# Altium project TCA.PrjPcb
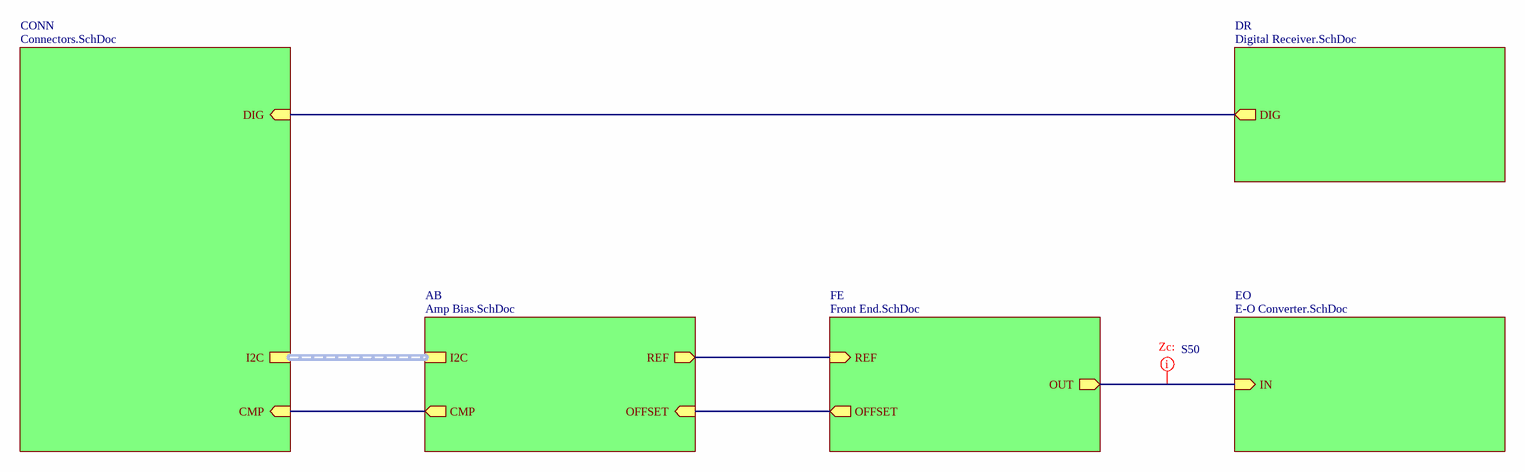
[diagram p0: Top.SchDoc]
6 sheets, 65 parts. Net scope: hierarchical (ports join the sheet entries above them; power ports are global).
Board file: TCA.PcbDoc
Sheets:
  Top.SchDoc
    CONN = Connectors.SchDoc
    AB = Amp Bias.SchDoc
    FE = Front End.SchDoc
    EO = E-O Converter.SchDoc
    DR = Digital Receiver.SchDoc

## Sheet Top.SchDoc
size 406 x 304 mm; SheetNumber: 1; SheetTotal: 6

### Sub-sheets
AB = Amp Bias.SchDoc: REF (out), OFFSET (in), I2C (harness I2C), CMP (out)
CONN = Connectors.SchDoc: I2C (harness I2C), CMP (in), DIG (in)
DR = Digital Receiver.SchDoc: DIG (out)
EO = E-O Converter.SchDoc: IN (in)
FE = Front End.SchDoc: OUT (out), REF (in), OFFSET (out)

### Nets
CMP: sheet CONN/CMP, sheet AB/CMP
DIG: sheet CONN/DIG, sheet DR/DIG
OFFSET: sheet AB/OFFSET, sheet FE/OFFSET
OUT: sheet FE/OUT, sheet EO/IN
REF: sheet AB/REF, sheet FE/REF

### Buses and harness runs
harness sheet AB/I2C = sheet CONN/I2C

### Layout directives
net class S50: OUT

### Notes on the sheet
- Rev
- Sheet Name:
- Date:
- Sheet
- Designer:
- of

## Sheet Connectors.SchDoc
size 406 x 304 mm; SheetNumber: 5; SheetTotal: 6
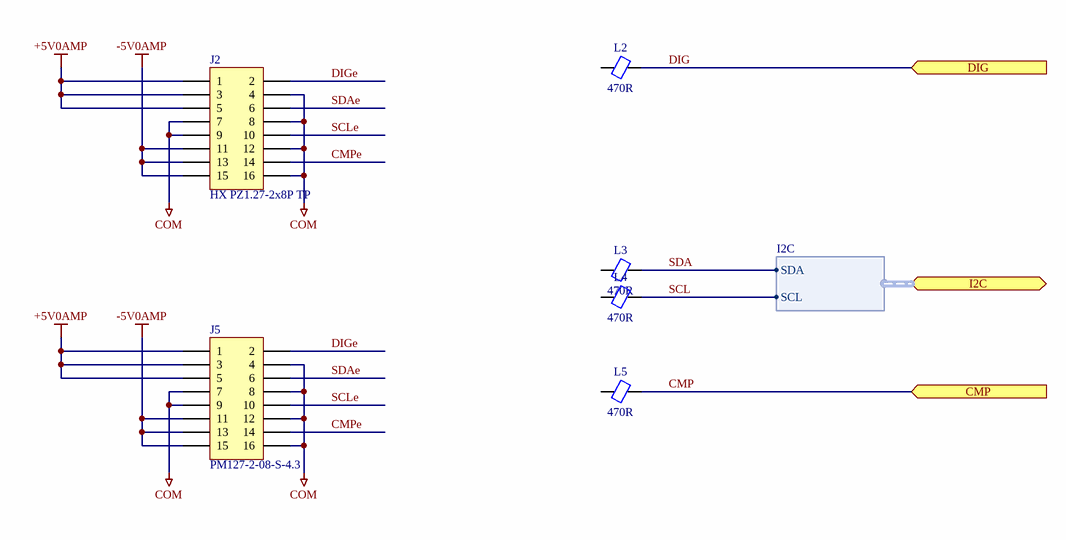
[diagram p1: Connectors.SchDoc]

### Parts
J2  HX PZ1.27-2x8P TP  [HANXIA_HX PZ1.27-2x8P TP]
J5  PM127-2-08-S-4.3  [HCTL_PM127-2-08-S-4.3]
L2  470R  [INDC1005X05N]
L3  470R  [INDC1005X05N]
L4  470R  [INDC1005X05N]
L5  470R  [INDC1005X05N]

### Ports
CMP (in), DIG (in), I2C (bidir, harness I2C)

### Harnesses
I2C: SDA, SCL

### Nets
+5V0AMP: J2.1 J2.3 J2.5 J5.1 J5.3 J5.5
-5V0AMP: J2.11 J2.13 J2.15 J5.11 J5.13 J5.15
COM: J2.4 J2.7 J2.8 J2.9 J2.12 J2.16 J5.4 J5.7 J5.8 J5.9 J5.12 J5.16
CMP: L5.2 ; port CMP
CMPe: J2.14 J5.14
DIG: L2.2 ; port DIG
DIGe: J2.2 J5.2
SCL: L4.2 ; port I2C.SCL
SCLe: J2.10 J5.10
SDA: L3.2 ; port I2C.SDA
SDAe: J2.6 J5.6

Not connected (* = marked no-connect by the designer): L2 1; L3 1; L4 1; L5 1

### Notes on the sheet
- Rev
- Sheet Name:
- Date:
- Sheet
- Designer:
- of

### Library data of the parts
J2 = CONN,Hdr,2x8 Pin,1.27mm,SMD: CONN HEADER 16POS 1.27mm DUAL ROW SMD; Manufacturer 1: hanxia; Vendor 1 Part Number: C41376040; Vendor 1: LCSC; Part Name: CONN,Hdr,2x8 Pin,1.27mm,SMD; CreatedBy: Judd Foster; HelpURL: https://www.lcsc.com/datasheet/C41376040.pdf?spm=wm.sxq.inf.ggs___wm.fly.bg.0.xh&lcsc_vid=T1ELXwUHQlNYVlZRE1JdXlRQFVgNBF1eTlFXBVxWRAAxVlNeQ1lYVlFUQlNXXjsOAxUeFF5JWBYZEEoKFBINSQcJGk4eFQsCAgIaSgADAwAHC0slRFhZUlVVQ08GEwkK; Manufacturer 1 Part Number: HX PZ1.27-2x8P TP
J5 = CONN,Rcpt,2x8 Pin,1.27mm,SMD: CONN SOCKET 16POS 1.27mm DUAL ROW SMD; Manufacturer 1: HCTL; Vendor 1 Part Number: C3975134; Vendor 1: LCSC; Part Name: CONN,Rcpt,2x8 Pin,1.27mm,SMD; CreatedBy: Judd Foster; HelpURL: https://www.lcsc.com/datasheet/C3975134.pdf?spm=wm.sxq.inf.ggs___wm.fly.bg.0.xh&lcsc_vid=T1ELXwUHQlNYVlZRE1JdXlRQFVgNBF1eTlFXBVxWRAAxVlNeQ1lYVldfR1VbXjsOAxUeFF5JWBYZEEoKFBINSQcJGk4dAgUUFAk%3D; Manufacturer 1 Part Number: PM127-2-08-S-4.3
L2-L5 = Ferrite,470R@100MHz,0402: 470 Ohms @ 100 MHz 1 Power Line Ferrite Bead 0402 (1005 Metric) 1A 200mOhm; Manufacturer 1: Murata Electronics; Manufacturer 1 Part Number: BLM15PX471SN1D; Vendor 1 Part Number: 490-10662-1-ND; Vendor 1: Digikey; Part Name: Ferrite,470R@100MHz,0402; CreatedBy: Judd Foster; HelpURL: https://www.murata.com/en-us/products/productdata/8796740059166/ENFA0018.pdf; Value: 470R

## Sheet Amp Bias.SchDoc
size 406 x 304 mm; SheetNumber: 2; SheetTotal: 6
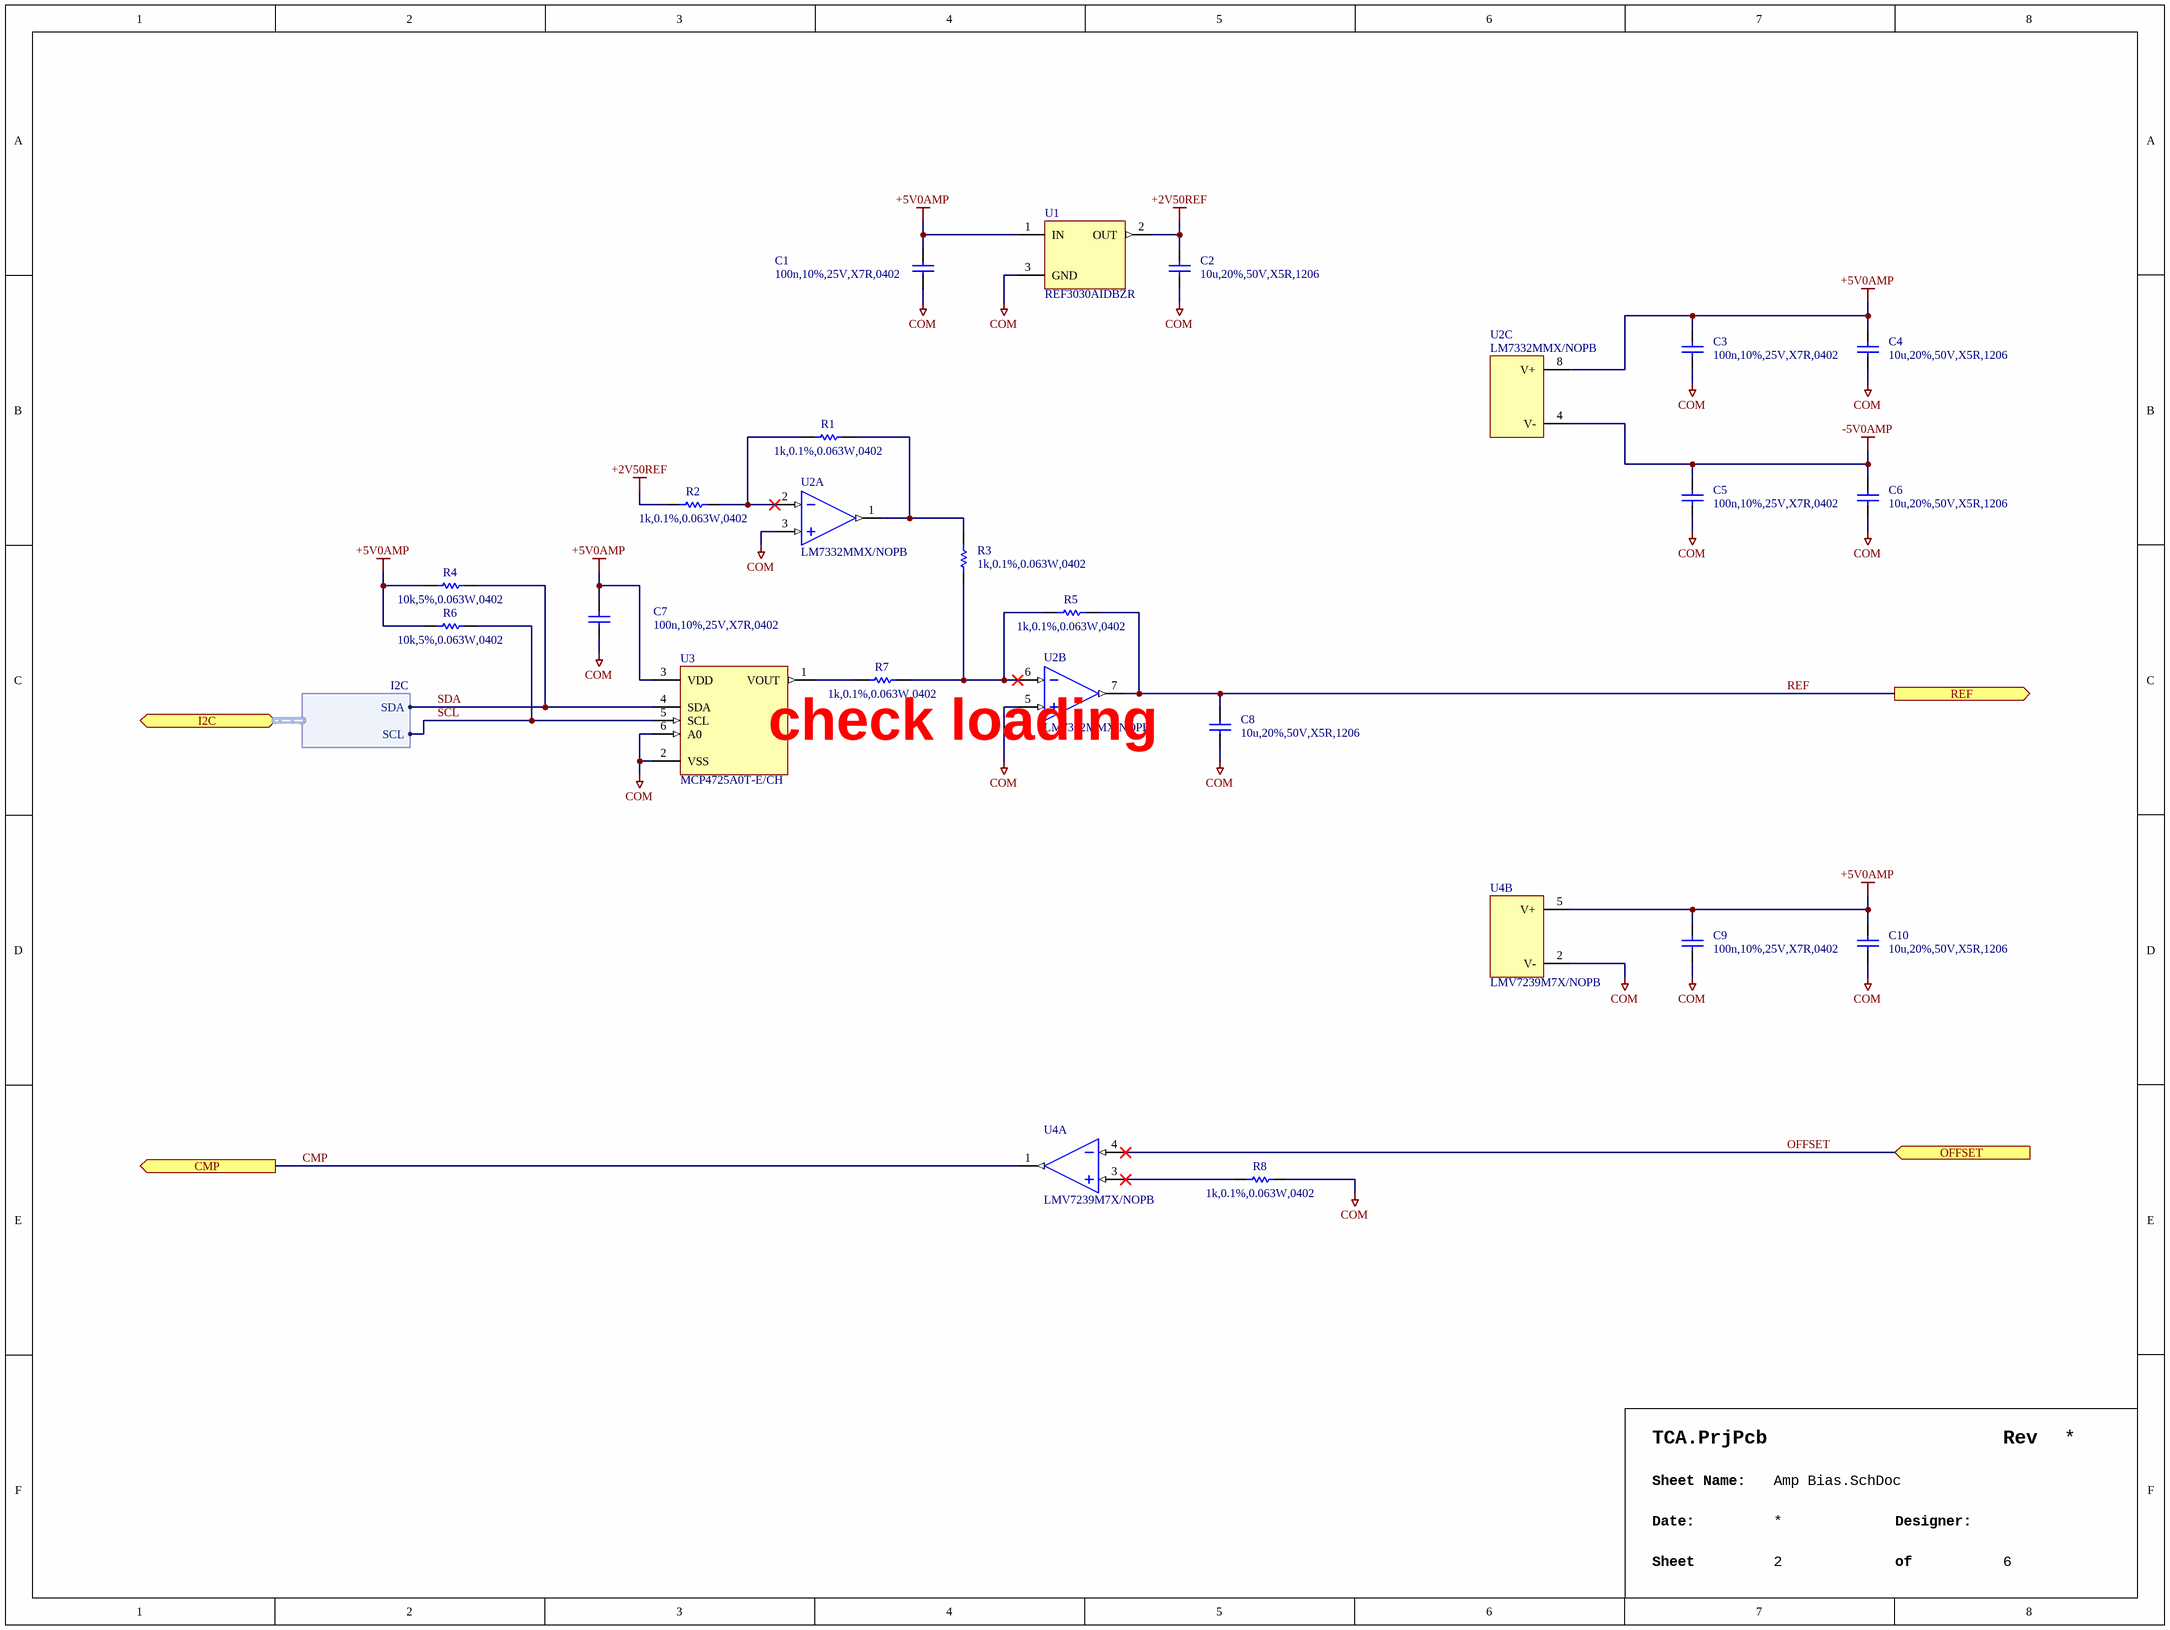
[diagram p2: Amp Bias.SchDoc]

### Parts
C1  100n,10%,25V,X7R,0402  [CAPC1005X06N]
C2  10u,20%,50V,X5R,1206  [CAPC3216X16N]
C3  100n,10%,25V,X7R,0402  [CAPC1005X06N]
C4  10u,20%,50V,X5R,1206  [CAPC3216X16N]
C5  100n,10%,25V,X7R,0402  [CAPC1005X06N]
C6  10u,20%,50V,X5R,1206  [CAPC3216X16N]
C7  100n,10%,25V,X7R,0402  [CAPC1005X06N]
C8  10u,20%,50V,X5R,1206  [CAPC3216X16N]
C9  100n,10%,25V,X7R,0402  [CAPC1005X06N]
C10  10u,20%,50V,X5R,1206  [CAPC3216X16N]
R1  1k,0.1%,0.063W,0402  [RESC1005X04N]
R2  1k,0.1%,0.063W,0402  [RESC1005X04N]
R3  1k,0.1%,0.063W,0402  [RESC1005X04N]
R4  10k,5%,0.063W,0402  [RESC1005X04N]
R5  1k,0.1%,0.063W,0402  [RESC1005X04N]
R6  10k,5%,0.063W,0402  [RESC1005X04N]
R7  1k,0.1%,0.063W,0402  [RESC1005X04N]
R8  1k,0.1%,0.063W,0402  [RESC1005X04N]
U1  REF3030AIDBZR  [SOT95P237X112-3N]
U2  LM7332MMX/NOPB  [TEXASINSTRUMENTS_PKG_DGK0008A]  (parts A,B,C of 3)
U3  MCP4725A0T-E/CH  [SOTFL95P260X145-6]
U4  LMV7239M7X/NOPB  [SOTFL65P210X110-6N]  (parts A,B of 2)

### Ports
CMP (out), I2C (bidir, harness I2C), OFFSET (in), REF (out)

### Harnesses
I2C: SDA, SCL

### Nets
+2V50REF: C2.2 R2.1 U1.2(OUT)
+5V0AMP: C1.2 C3.2 C4.2 C7.2 C9.2 C10.2 R4.2 R6.2 U1.1(IN) U2.8(V+) U3.3(VDD) U4.5(V+)
-5V0AMP: C5.2 C6.2 U2.4(V-)
COM: C1.1 C2.1 C3.1 C4.1 C5.1 C6.1 C7.1 C8.1 C9.1 C10.1 R8.2 U1.3(GND) U2.3(INA+) U2.5(INB+) U3.2(VSS) U3.6(A0) U4.2(V-)
CMP: U4.1(VOUT) ; port CMP
OFFSET: U4.4(IN-) ; port OFFSET
REF: C8.2 R5.2 U2.7(OUTB) ; port REF
SCL: R6.1 U3.5(SCL) ; port I2C.SCL
SDA: R4.1 U3.4(SDA) ; port I2C.SDA
NetR1_1: R1.1 R2.2 U2.2(INA-)
NetR1_2: R1.2 R3.1 U2.1(OUTA)
NetR3_2: R3.2 R5.1 R7.2 U2.6(INB-)
NetR7_1: R7.1 U3.1(VOUT)
NetR8_1: R8.1 U4.3(IN+)

### Notes on the sheet
- check loading
- Rev
- Sheet Name:
- Date:
- Sheet
- Designer:
- of

### Library data of the parts
C1 C3 C5 C7 C9 = CAP,Cer,100nF,10%,25V,X7R,0402: 0.1ï¿½F ï¿½10% 25V Ceramic Capacitor X7R 0402 (1005 Metric); Manufacturer 1: Murata Electronics; Manufacturer 1 Part Number: GRM155R71E104KE14J; Vendor 1 Part Number: 490-14603-1-ND; Vendor 1: DigiKey; Value: 100nF; Part Name: CAP,Cer,100nF,10%,25V,X7R,0402; CreatedBy: Judd Foster; HelpURL: https://search.murata.co.jp/Ceramy/image/img/A01X/G101/ENG/GRM155R71E104KE14-01.pdf
C2 C4 C6 C8 C10 = CAP,Cer,10uF,50VDC,X5R,1206: 10ï¿½F ï¿½20% 50V Ceramic Capacitor X5R 1206 (3216 Metric); Manufacturer 1: Samsung Electro-Mechanics; Manufacturer 1 Part Number: CL31A106MBHNNNE; Vendor 1 Part Number: 1276-6736-1-ND; Vendor 1: Digikey; Part Name: CAP,Cer,10uF,50VDC,X5R,1206; CreatedBy: Judd Foster; HelpURL: https://www.samsungsem.com/resources/file/global/support/product_catalog/MLCC.pdf; Value: 10u
R1-R3 R5 R7 R8 = RES,1k,0.1%,0.063W,0402: 1 kOhms Â±0.1% 0.063W, 1/16W Chip Resistor 0402 (1005 Metric) Thin Film; Manufacturer 1: YAGEO; Manufacturer 1 Part Number: RT0402BRE071KL; Vendor 1 Part Number: YAG2306CT-ND; Vendor 1: DigiKey; Part Name: RES,1k,0.1%,0.063W,0402; CreatedBy: Judd Foster; HelpURL: https://www.yageo.com/upload/media/product/app/datasheet/rchip/pyu-rt_1-to-0.01_rohs_l.pdf; Value: 1k
R4 R6 = RES,10k,5%,0.063W,0402: 10 kOhms ï¿½5% 0.063W, 1/16W Chip Resistor 0402 (1005 Metric) Automotive AEC-Q200 Thick Film; Manufacturer 1: Stackpole Electronics Inc; Manufacturer 1 Part Number: RMCF0402JT10K0; Vendor 1 Part Number: RMCF0402JT10K0CT-ND; Vendor 1: DIgikey; Part Name: RES,10k,5%,0.063W,0402; CreatedBy: Judd Foster; HelpURL: https://www.seielect.com/catalog/sei-rmcf_rmcp.pdf; Value: 10k
U1 = REF3030AIDBZR: 3V ï¿½0.2% 3.05V~5.5V 25mA Fixed SOT-23 Voltage References ROHS; Manufacturer 1: Texas Instruments; Vendor 1 Part Number: C38423; Vendor 1: LCSC; Part Name: REF3030AIDBZR; CreatedBy: Judd Foster; HelpURL: https://www.ti.com/lit/ds/symlink/ref3030.pdf?ts=1702271215532&ref_url=https%253A%252F%252Fwww.ti.com%252Fproduct%252FREF3030%252Fpart-details%252FREF3030AIDBZR; Manufacturer 1 Part Number: REF3030AIDBZR
U2 = LM7332MMX_NOPB: General Purpose Amplifier 2 Circuit Rail-to-Rail 8-VSSOP; Manufacturer 1: Texas Instruments; Vendor 1 Part Number: 296-LM7332MMX/NOPBCT-ND; Vendor 1: DigiKey; Part Name: LM7332MMX_NOPB; CreatedBy: Judd Foster; HelpURL: https://www.ti.com/lit/ds/symlink/lm7332.pdf?HQS=dis-dk-null-digikeymode-dsf-pf-null-wwe&ts=1730932081789&ref_url=https%253A%252F%252Fwww.ti.com%252Fgeneral%252Fdocs%252Fsuppproductinfo.tsp%253FdistId%253D10%2526gotoUrl%253Dhttps%253A%252F%252Fwww.ti.com%; Manufacturer 1 Part Number: LM7332MMX/NOPB
U3 = MCP4725A0T-E/CH: 6us 12 I2C 2.7V~5.5V SOT-23-6 Digital To Analog Converters (DACs) ROHS; Manufacturer 1: Microchip; Vendor 1 Part Number: C144198; Vendor 1: LCSC; Part Name: MCP4725A0T-E/CH; CreatedBy: Judd Foster; HelpURL: https://datasheet.lcsc.com/lcsc/1811151442_Microchip-Tech-MCP4725A0T-E-CH_C144198.pdf; Manufacturer 1 Part Number: MCP4725A0T-E/CH
U4 = LMV7239M7X/NOPB: Comparator General Purpose Push-Pull SC-70-5; Manufacturer 1: Texas Instruments; Vendor 1 Part Number: 296-35198-1-ND; Vendor 1: Digikey; Part Name: LMV7239M7X/NOPB; CreatedBy: Judd Foster; HelpURL: https://www.ti.com/general/docs/suppproductinfo.tsp?distId=10&gotoUrl=https%3A%2F%2Fwww.ti.com%2Flit%2Fgpn%2Flmv7235; Manufacturer 1 Part Number: LMV7239M7X/NOPB

## Sheet Front End.SchDoc
size 406 x 304 mm; SheetNumber: 4; SheetTotal: 6
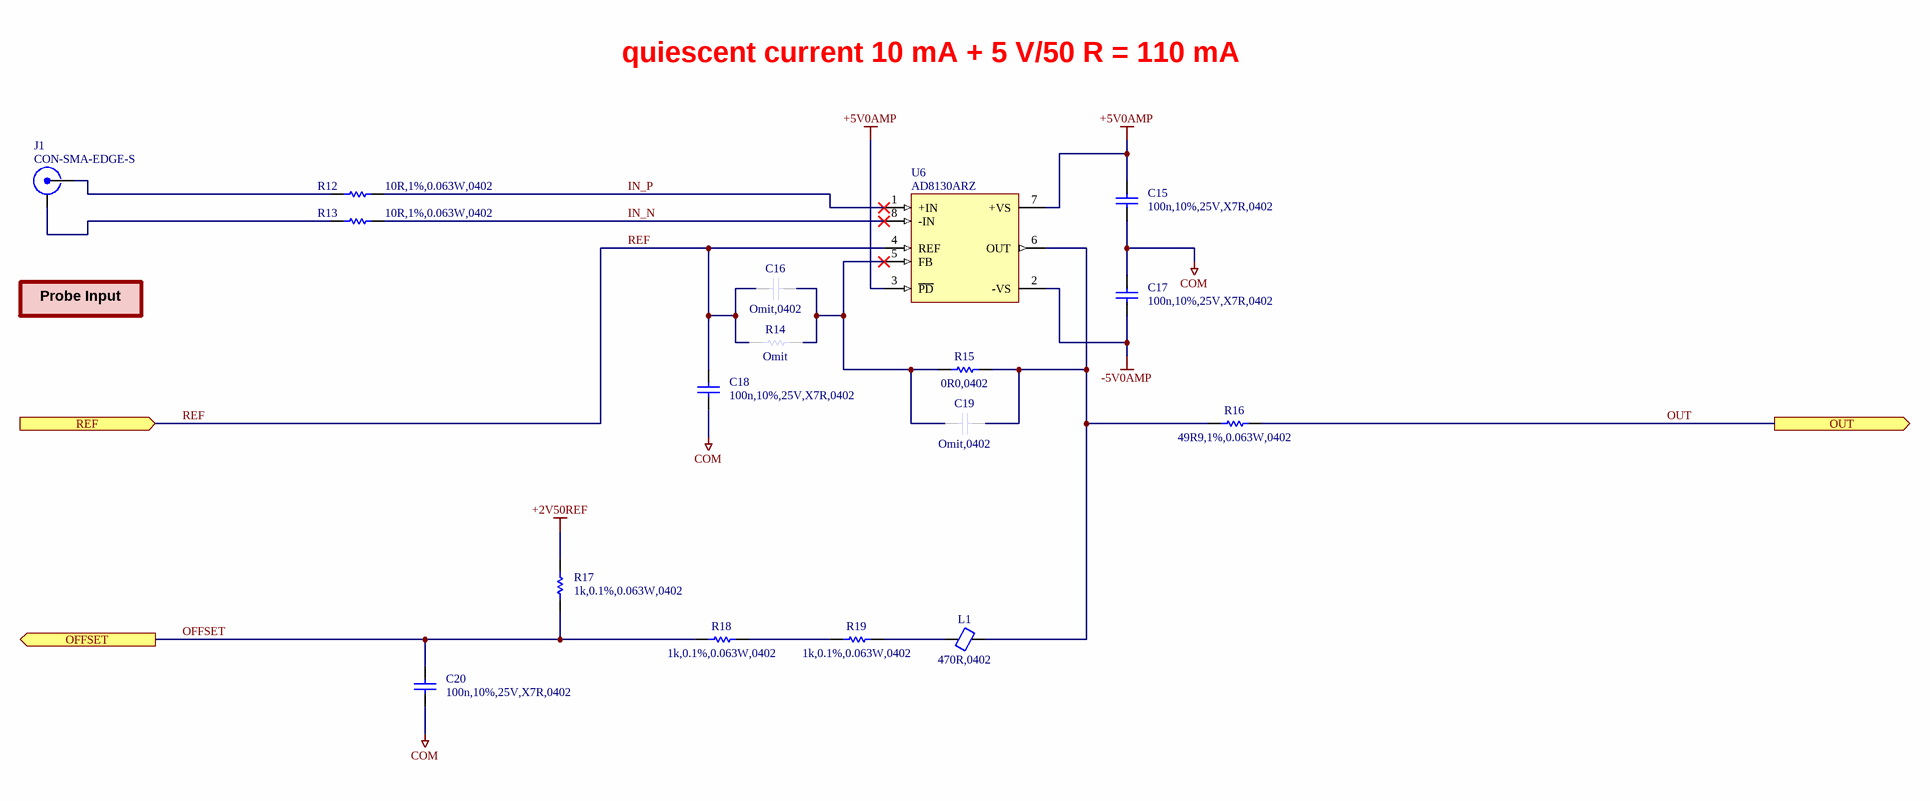
[diagram p3: Front End.SchDoc]

### Parts
C15  100n,10%,25V,X7R,0402  [CAPC1005X06N]
C16  Omit,0402  [CAPC1005X06N]  (no BOM)
C17  100n,10%,25V,X7R,0402  [CAPC1005X06N]
C18  100n,10%,25V,X7R,0402  [CAPC1005X06N]
C19  Omit,0402  [CAPC1005X06N]  (no BOM)
C20  100n,10%,25V,X7R,0402  [CAPC1005X06N]
J1  CON-SMA-EDGE-S  [RFSOLUTIONS_CON-SMA-EDGE-S]
L1  470R,0402  [INDC1005X05N]
R12  10R,1%,0.063W,0402  [RESC1005X04N]
R13  10R,1%,0.063W,0402  [RESC1005X04N]
R14  Omit  [RESC1005X04N]  (no BOM)
R15  0R0,0402  [RESC1005X04N]
R16  49R9,1%,0.063W,0402  [RESC1005X04N]
R17  1k,0.1%,0.063W,0402  [RESC1005X04N]
R18  1k,0.1%,0.063W,0402  [RESC1005X04N]
R19  1k,0.1%,0.063W,0402  [RESC1005X04N]
U6  AD8130ARZ  [ANALOGDEVICES_PKG_R-8]

### Ports
OFFSET (out), OUT (out), REF (in)

### Nets
+2V50REF: R17.2
+5V0AMP: C15.2 U6.3(~{PD}) U6.7(+VS)
-5V0AMP: C17.1 U6.2(-VS)
COM: C15.1 C17.2 C18.1 C20.1
IN_N: R13.2 U6.8(-IN)
IN_P: R12.2 U6.1(+IN)
OFFSET: C20.2 R17.1 R18.1 ; port OFFSET
OUT: R16.2 ; port OUT
REF: C16.1 C18.2 R14.1 U6.4(REF) ; port REF
NetC16_2: C16.2 C19.1 R14.2 R15.1 U6.5(FB)
NetC19_2: C19.2 L1.2 R15.2 R16.1 U6.6(OUT)
NetJ1_1: J1.1(RF) R12.1
NetJ1_2: J1.2(GND) R13.1
NetL1_1: L1.1 R19.2
NetR18_2: R18.2 R19.1

### Notes on the sheet
- quiescent current 10 mA + 5 V/50 R = 110 mA
- Probe Input
- Rev
- Sheet Name:
- Date:
- Sheet
- Designer:
- of

### Library data of the parts
C15 C17 C18 C20 = CAP,Cer,100nF,10%,25V,X7R,0402: as C1 on sheet Amp Bias; Part Name: CAP,Cer,100nF,10%,25V,X7R,0402; CreatedBy: Judd Foster; HelpURL: https://search.murata.co.jp/Ceramy/image/img/A01X/G101/ENG/GRM155R71E104KE14-01.pdf
C16 C19 = CAP,Omit,0402: Omit; Part Name: CAP,Omit,0402; CreatedBy: Judd Foster; HelpURL: N/A; Manufacturer 1: N/A; Manufacturer 1 Part Number: N/A; Vendor 1: N/A; Vendor 1 Part Number: N/A; Value: Omit
J1 = Conn,RF,SMA,Fem,50R,Edge,SMD: SMA Connector Jack, Female Socket Board Edge, End Launch Solder; Manufacturer 1: RF Solutions; Vendor 1 Part Number: CON-SMA-EDGE-S-ND; Vendor 1: DigiKey; Part Name: Conn,RF,SMA,Fem,50R,Edge,SMD; CreatedBy: Judd Foster; HelpURL: https://www.rfsolutions.co.uk/content/download-files/CON-SMA-EDGE-6-DATASHEET.pdf; Manufacturer 1 Part Number: CON-SMA-EDGE-S
L1 = Ferrite,470R@100MHz,0402: 470 Ohms @ 100 MHz 1 Power Line Ferrite Bead 0402 (1005 Metric) 1A 200mOhm; Manufacturer 1: Murata Electronics; Manufacturer 1 Part Number: BLM15PX471SN1D; Vendor 1 Part Number: 490-10662-1-ND; Vendor 1: Digikey; Value: 470; Part Name: Ferrite,470R@100MHz,0402; CreatedBy: Judd Foster; HelpURL: https://www.murata.com/en-us/products/productdata/8796740059166/ENFA0018.pdf
R12 R13 = RES,10R,1%,0.063W,0402: 10 Ohms ï¿½1% 0.063W, 1/16W Chip Resistor 0402 (1005 Metric) Automotive AEC-Q200 Thick Film; Manufacturer 1: Panasonic Electronic Components; Manufacturer 1 Part Number: ERJ-2RKF10R0X; Vendor 1 Part Number: P10.0LCT-ND; Vendor 1: Digikey; Part Name: RES,10R,1%,0.063W,0402; CreatedBy: Judd Foster; HelpURL: https://industrial.panasonic.com/cdbs/www-data/pdf/RDA0000/AOA0000C304.pdf; Value: 10R
R14 = RES,Omit,0402: Part Name: RES,Omit,0402; CreatedBy: Judd Foster; HelpURL: N/A; Manufacturer 1: N/A; Manufacturer 1 Part Number: N/A; Vendor 1: N/A; Vendor 1 Part Number: N/A; Value: Omit
R15 = RES,0R0,0402: 0 Ohms Jumper 0.1W, 1/10W Chip Resistor 0402 (1005 Metric) Automotive AEC-Q200 Thick Film; Manufacturer 1: Panasonic Electronic Components; Manufacturer 1 Part Number: ERJ-2GE0R00X; Vendor 1 Part Number: P0.0JCT-ND; Vendor 1: Digikey; Value: 0; Part Name: RES,0R0,0402; CreatedBy: Judd Foster; HelpURL: https://industrial.panasonic.com/cdbs/www-data/pdf/RDA0000/AOA0000C301.pdf
R16 = RES,49R9,1%,0.063W,0402: 49.9 Ohms Â±1% 0.063W, 1/16W Chip Resistor 0402 (1005 Metric) Moisture Resistant Thick Film; Manufacturer 1: YAGEO; Manufacturer 1 Part Number: RC0402FR-0749R9L; Vendor 1 Part Number: 311-49.9LRCT-ND; Vendor 1: DigiKey; Part Name: RES,49R9,1%,0.063W,0402; CreatedBy: Judd Foster; HelpURL: https://www.yageo.com/upload/media/product/products/datasheet/rchip/PYu-RC_Group_51_RoHS_L_12.pdf; Value: 49R9
R17-R19 = RES,1k,0.1%,0.063W,0402: as R1 on sheet Amp Bias; Part Name: RES,1k,0.1%,0.063W,0402; CreatedBy: Judd Foster; HelpURL: https://www.yageo.com/upload/media/product/app/datasheet/rchip/pyu-rt_1-to-0.01_rohs_l.pdf; Value: 1k
U6 = AD8130ARZ: Differential Amplifier 1 Circuit 8-SOIC; Manufacturer 1: Analog Devices; Vendor 1 Part Number: 505-AD8130ARZ-ND; Vendor 1: DigiKey; Part Name: AD8130ARZ; CreatedBy: Judd Foster; HelpURL: https://www.analog.com/media/en/technical-documentation/data-sheets/AD8129_8130.pdf; Manufacturer 1 Part Number: AD8130ARZ

## Sheet E-O Converter.SchDoc
size 406 x 304 mm; SheetNumber: 3; SheetTotal: 6
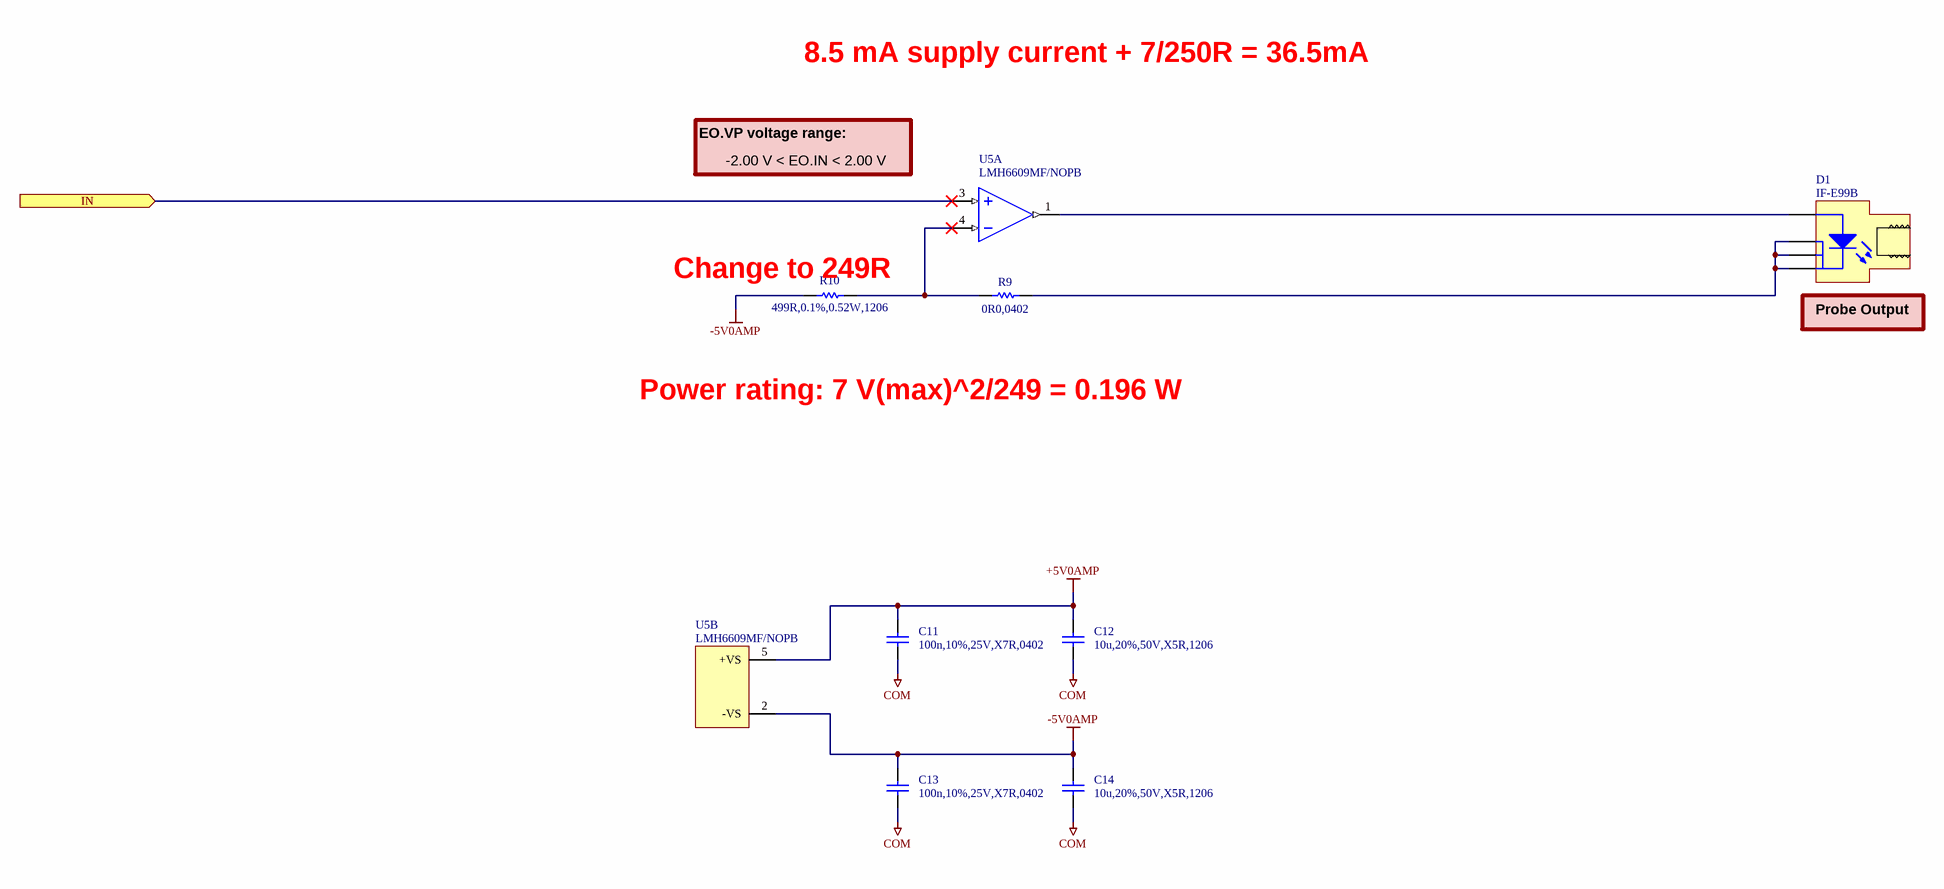
[diagram p4: E-O Converter.SchDoc]

### Parts
C11  100n,10%,25V,X7R,0402  [CAPC1005X06N]
C12  10u,20%,50V,X5R,1206  [CAPC3216X16N]
C13  100n,10%,25V,X7R,0402  [CAPC1005X06N]
C14  10u,20%,50V,X5R,1206  [CAPC3216X16N]
D1  IF-E99B  [INDUSTRIALFIBEROPTICS_IF-E99B]
R9  0R0,0402  [RESC1005X04N]
R10  499R,0.1%,0.52W,1206  [VISHAY_PKG_TNPW1206]
U5  LMH6609MF/NOPB  [TEXASINSTRUMENTS_PKG_DBV0005A]  (parts A,B of 2)

### Ports
IN (in)

### Nets
+5V0AMP: C11.2 C12.2 U5.5(+VS)
-5V0AMP: C13.2 C14.2 R10.1 U5.2(-VS)
COM: C11.1 C12.1 C13.1 C14.1
OUT: U5.3(IN+) ; port IN
NetD1_1: D1.1(K) D1.2(K) D1.4(K) R9.2
NetD1_3: D1.3(A) U5.1(OUT1)
NetR9_1: R9.1 R10.2 U5.4(IN-)

### Notes on the sheet
- 8.5 mA supply current + 7/250R = 36.5mA
- EO.VP voltage range:
- -2.00 V < EO.IN < 2.00 V
- (near R10) Change to 249R
- (near D1) Probe Output
- Power rating: 7 V(max)^2/249 = 0.196 W
- Rev
- Sheet Name:
- Date:
- Sheet
- Designer:
- of

### Library data of the parts
C11 C13 = CAP,Cer,100nF,10%,25V,X7R,0402: as C1 on sheet Amp Bias; Part Name: CAP,Cer,100nF,10%,25V,X7R,0402; CreatedBy: Judd Foster; HelpURL: https://search.murata.co.jp/Ceramy/image/img/A01X/G101/ENG/GRM155R71E104KE14-01.pdf
C12 C14 = CAP,Cer,10uF,50VDC,X5R,1206: as C2 on sheet Amp Bias; Part Name: CAP,Cer,10uF,50VDC,X5R,1206; CreatedBy: Judd Foster; HelpURL: https://www.samsungsem.com/resources/file/global/support/product_catalog/MLCC.pdf; Value: 10u
D1 = XMITTER,FIBER OPTIC,650NM,1.9V,IF-E99B: Fiber Optic Transmitter 650nm 1.9V 50 mA Connector-less; Manufacturer 1: Industrial Fiber Optics; Vendor 1 Part Number: FB161-ND; Vendor 1: DigiKey; Part Name: XMITTER,FIBER OPTIC,650NM,1.9V,IF-E99B; CreatedBy: Judd Foster; HelpURL: https://i-fiberoptics.com/pdf/if-e99bdatasheet.pdf; Manufacturer 1 Part Number: IF-E99B
R9 = RES,0R0,0402: as R15 on sheet Front End; Part Name: RES,0R0,0402; CreatedBy: Judd Foster; HelpURL: https://industrial.panasonic.com/cdbs/www-data/pdf/RDA0000/AOA0000C301.pdf
R10 = RES,499R,0.1%,0.52W,1206: 499 Ohms Â±0.1% 0.52W Chip Resistor 1206 (3216 Metric) Anti-Sulfur, Automotive AEC-Q200, Moisture Resistant Thin Film; Manufacturer 1: Vishay Dale; Manufacturer 1 Part Number: TNPW1206499RBEEA; Vendor 1 Part Number: 541-3877-1-ND; Vendor 1: DigiKey; Part Name: RES,499R,0.1%,0.52W,1206; CreatedBy: Judd Foster; HelpURL: https://www.vishay.com/docs/28758/tnpw_e3.pdf; Value: 499R
U5 = LMH6609MF_NOPB: Voltage Feedback Amplifier 1 Circuit SOT-23-5; Manufacturer 1: Texas Instruments; Vendor 1 Part Number: LMH6609MF/NOPBCT-ND; Vendor 1: DigiKey; Part Name: LMH6609MF_NOPB; CreatedBy: Judd Foster; HelpURL: https://www.ti.com/lit/ds/symlink/lmh6609.pdf; Manufacturer 1 Part Number: LMH6609MF/NOPB

## Sheet Digital Receiver.SchDoc
size 406 x 304 mm; SheetNumber: 6; SheetTotal: 6
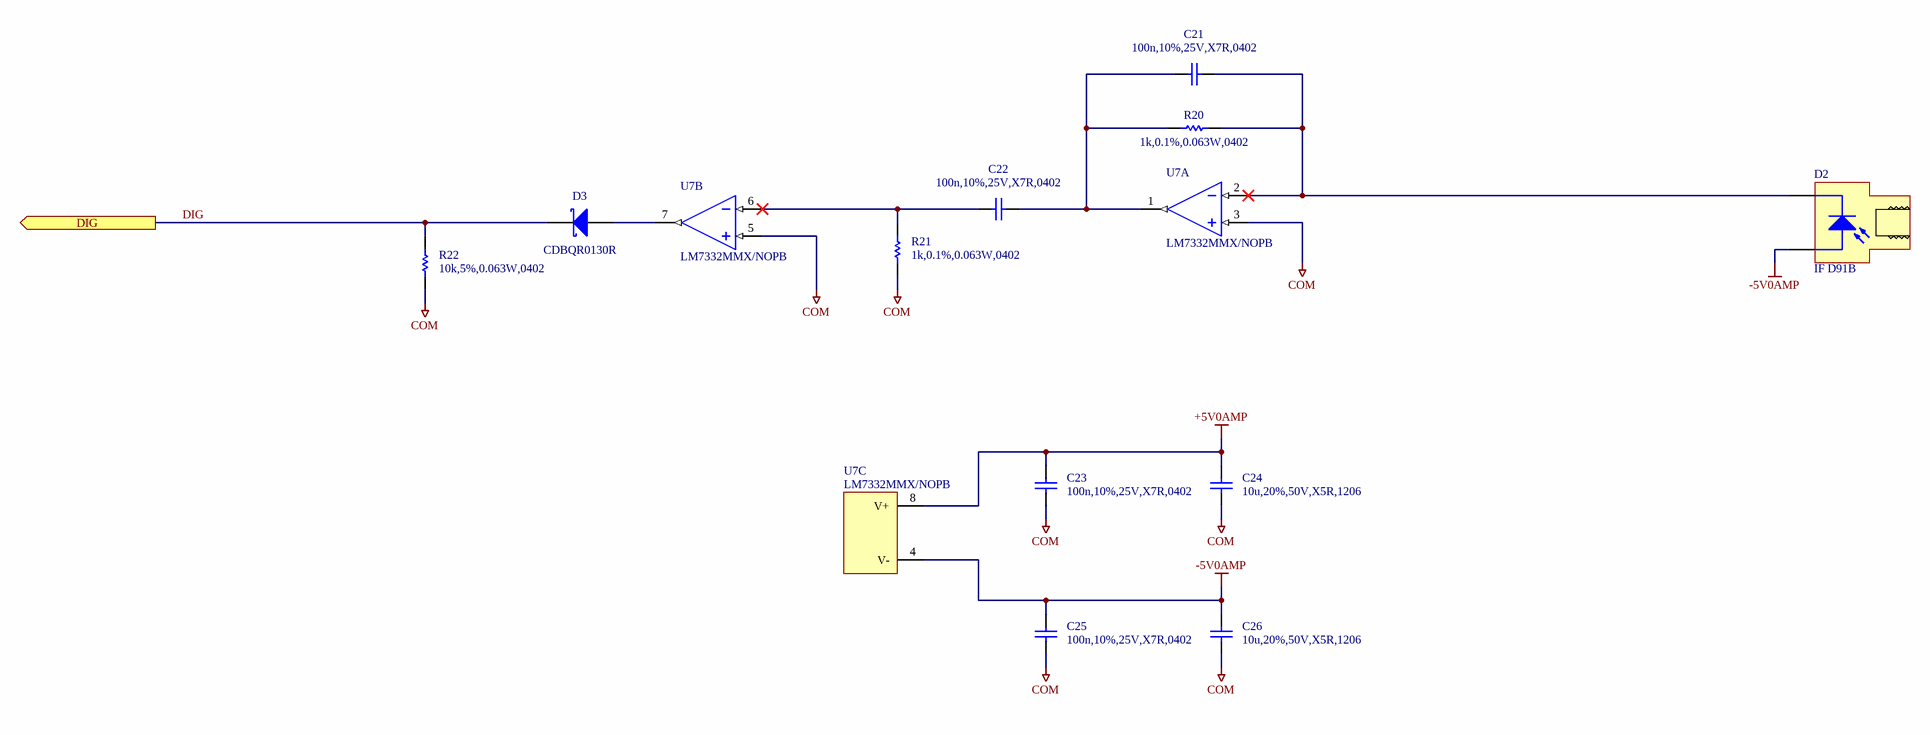
[diagram p5: Digital Receiver.SchDoc]

### Parts
C21  100n,10%,25V,X7R,0402  [CAPC1005X06N]
C22  100n,10%,25V,X7R,0402  [CAPC1005X06N]
C23  100n,10%,25V,X7R,0402  [CAPC1005X06N]
C24  10u,20%,50V,X5R,1206  [CAPC3216X16N]
C25  100n,10%,25V,X7R,0402  [CAPC1005X06N]
C26  10u,20%,50V,X5R,1206  [CAPC3216X16N]
D2  IF D91B  [INDUSTRIALFIBEROPTICS_IF-D91B]
D3  CDBQR0130R  [DFN65P100X50-2N]
R20  1k,0.1%,0.063W,0402  [RESC1005X04N]
R21  1k,0.1%,0.063W,0402  [RESC1005X04N]
R22  10k,5%,0.063W,0402  [RESC1005X04N]
U7  LM7332MMX/NOPB  [TEXASINSTRUMENTS_PKG_DGK0008A]  (parts A,B,C of 3)

### Ports
DIG (out)

### Nets
+5V0AMP: C23.2 C24.2 U7.8(V+)
-5V0AMP: C25.2 C26.2 D2.1(A) U7.4(V-)
COM: C23.1 C24.1 C25.1 C26.1 R21.1 R22.2 U7.3(INA+) U7.5(INB+)
DIG: D3.1(K) R22.1 ; port DIG
NetC21_1: C21.1 D2.2(K) R20.2 U7.2(INA-)
NetC21_2: C21.2 C22.1 R20.1 U7.1(OUTA)
NetC22_2: C22.2 R21.2 U7.6(INB-)
NetD3_2: D3.2(A) U7.7(OUTB)

### Notes on the sheet
- Rev
- Sheet Name:
- Date:
- Sheet
- Designer:
- of

### Library data of the parts
C21-C23 C25 = CAP,Cer,100nF,10%,25V,X7R,0402: as C1 on sheet Amp Bias; Part Name: CAP,Cer,100nF,10%,25V,X7R,0402; CreatedBy: Judd Foster; HelpURL: https://search.murata.co.jp/Ceramy/image/img/A01X/G101/ENG/GRM155R71E104KE14-01.pdf
C24 C26 = CAP,Cer,10uF,50VDC,X5R,1206: as C2 on sheet Amp Bias; Part Name: CAP,Cer,10uF,50VDC,X5R,1206; CreatedBy: Judd Foster; HelpURL: https://www.samsungsem.com/resources/file/global/support/product_catalog/MLCC.pdf; Value: 10u
D2 = RECEIVER,FIBER OPTIC,450-1050NM,IF-D91B: Fiber Optic Receiver General Purpose 100Mbps; Manufacturer 1: Industrial Fiber Optics; Vendor 1 Part Number: FB200-ND; Vendor 1: DigiKey; Part Name: RECEIVER,FIBER OPTIC,450-1050NM,IF-D91B; CreatedBy: Judd Foster; HelpURL: https://i-fiberoptics.com/pdf/ifd91b-1809.pdf; Manufacturer 1 Part Number: IF D91B
D3 = DIODE,Schottky,30V,100mA,SMD: Diode 30 V 100mA Surface Mount 0402C/SOD-923F; Manufacturer 1: Comchip Technology; Vendor 1 Part Number: 641-1272-1-ND; Vendor 1: Digikey; Part Name: DIODE,Schottky,30V,100mA,SMD; CreatedBy: Judd Foster; HelpURL: https://mm.digikey.com/Volume0/opasdata/d220001/medias/docus/3209/CDBQR0130R.pdf; Manufacturer 1 Part Number: CDBQR0130R
R20 R21 = RES,1k,0.1%,0.063W,0402: as R1 on sheet Amp Bias; Part Name: RES,1k,0.1%,0.063W,0402; CreatedBy: Judd Foster; HelpURL: https://www.yageo.com/upload/media/product/app/datasheet/rchip/pyu-rt_1-to-0.01_rohs_l.pdf; Value: 1k
R22 = RES,10k,5%,0.063W,0402: as R4 on sheet Amp Bias; Part Name: RES,10k,5%,0.063W,0402; CreatedBy: Judd Foster; HelpURL: https://www.seielect.com/catalog/sei-rmcf_rmcp.pdf; Value: 10k
U7 = LM7332MMX_NOPB: as U2 on sheet Amp Bias; Part Name: LM7332MMX_NOPB; CreatedBy: Judd Foster; HelpURL: https://www.ti.com/lit/ds/symlink/lm7332.pdf?HQS=dis-dk-null-digikeymode-dsf-pf-null-wwe&ts=1730932081789&ref_url=https%253A%252F%252Fwww.ti.com%252Fgeneral%252Fdocs%252Fsuppproductinfo.tsp%253FdistId%253D10%2526gotoUrl%253Dhttps%253A%252F%252Fwww.ti.com%; Manufacturer 1 Part Number: LM7332MMX/NOPB

## Nets that join several sheets
+2V50REF: Amp Bias (C2.2 R2.1 U1.2), Front End (R17.2)
+5V0AMP: Connectors (6 pins), Amp Bias (12 pins), Front End (C15.2 U6.3 U6.7), E-O Converter (C11.2 C12.2 U5.5), Digital Receiver (C23.2 C24.2 U7.8)
-5V0AMP: Connectors (6 pins), Amp Bias (C5.2 C6.2 U2.4), Front End (C17.1 U6.2), E-O Converter (C13.2 C14.2 R10.1 U5.2), Digital Receiver (C25.2 C26.2 D2.1 U7.4)
COM: Connectors (12 pins), Amp Bias (17 pins), Front End (C15.1 C17.2 C18.1 C20.1), E-O Converter (C11.1 C12.1 C13.1 C14.1), Digital Receiver (8 pins)
CMP: Connectors (L5.2), Amp Bias (U4.1)
DIG: Connectors (L2.2), Digital Receiver (D3.1 R22.1)
OFFSET: Amp Bias (U4.4), Front End (C20.2 R17.1 R18.1)
OUT: Front End (R16.2), E-O Converter (U5.3)
REF: Amp Bias (C8.2 R5.2 U2.7), Front End (C16.1 C18.2 R14.1 U6.4)
SCL: Connectors (L4.2), Amp Bias (R6.1 U3.5)
SDA: Connectors (L3.2), Amp Bias (R4.1 U3.4)